# Altium schematic sheet SwitchingRegulator.SchDoc
size A
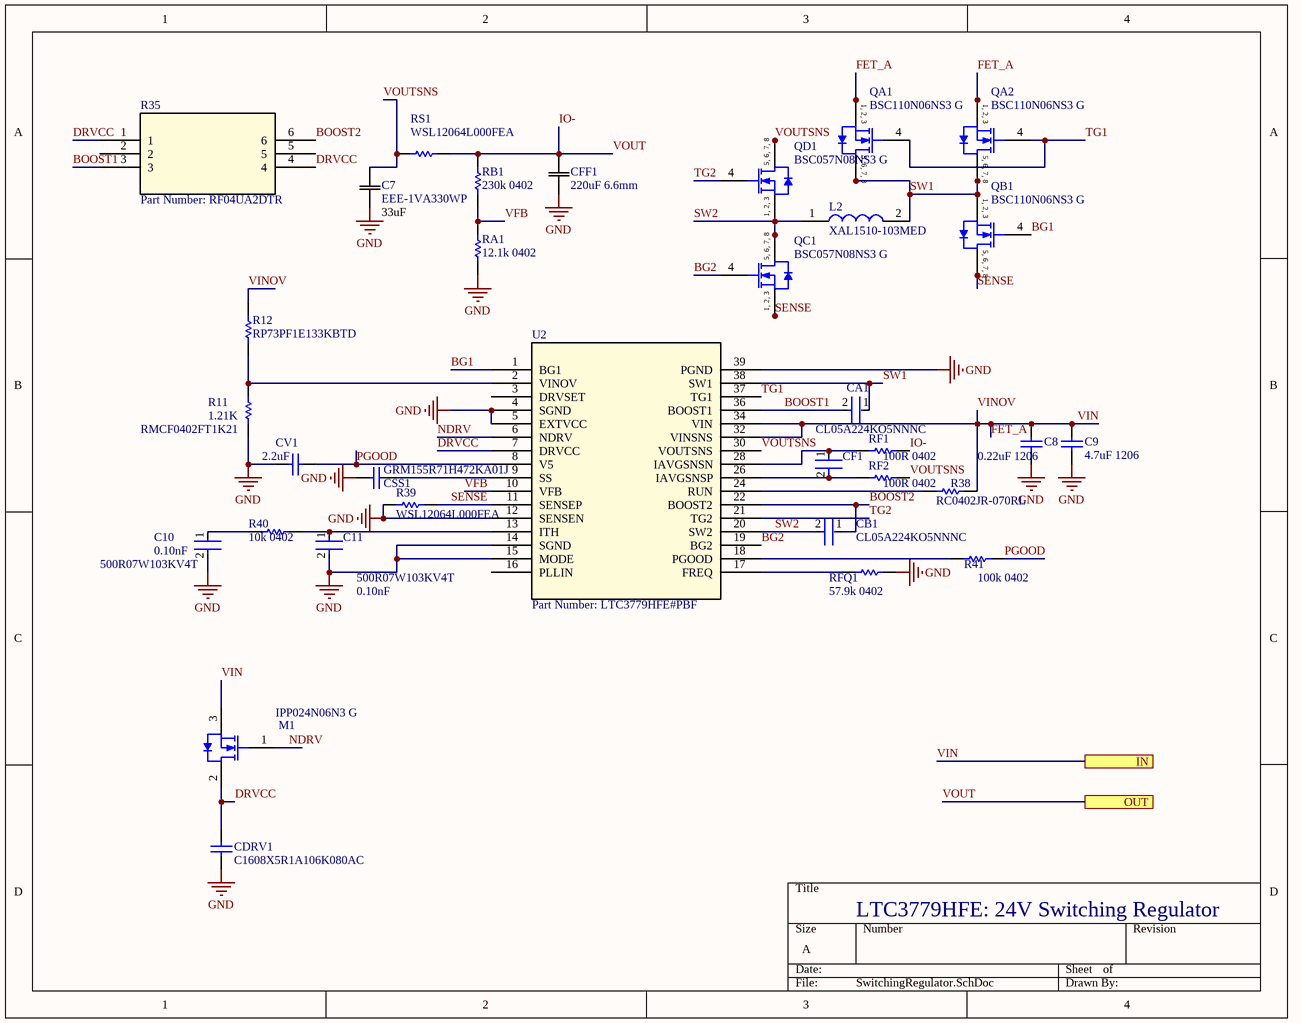
[diagram p0: SwitchingRegulator.SchDoc]

## Parts
C7  EEE-1VA330WP  value 33uF  [CAPAE660X800N]
C8  0.22uF 1206  [CAPC1608X90X35ML10T15]
C9  4.7uF 1206  [CAPC3216X180X50ML20T25]
C10  500R07W103KV4T  Capacitance: 0.10nF  [FP-GRM15-MFG]
C11  500R07W103KV4T  Capacitance: 0.10nF  [FP-GRM15-MFG]
CA1  CL05A224KO5NNNC  [FP-GRM15-MFG]
CB1  CL05A224KO5NNNC  [FP-GRM15-MFG]
CDRV1  C1608X5R1A106K080AC  [CAPC1608X90X20ML10]
CF1  C1608X5R1C335K080AC  [FP-GRM15-MFG]  (value not drawn)
CFF1  220uF 6.6mm  [CAPAE660X800N]
CSS1  GRM155R71H472KA01J  [CAPC1005X55X25NL05T10]
CV1  value 2.2uF  [CAPC1005X55X25ML05T10]  (hidden comment: GRM155R60J225ME15D)
L2  XAL1510-103MED  [XAL1513153MEB]
M1  IPP024N06N3 G  [INF-PG-TO220-3-1_A_V]
QA1  BSC110N06NS3 G  [INF-PG-TDSON-8-1_V]
QA2  BSC110N06NS3 G  [INF-PG-TDSON-8-1_V]
QB1  BSC110N06NS3 G  [INF-PG-TDSON-8-1_V]
QC1  BSC057N08NS3 G  [INF-PG-TDSON-8-1_V]
QD1  BSC057N08NS3 G  [INF-PG-TDSON-8-1_V]
R11  RMCF0402FT1K21  value 1.21K  [RESC1005X40X25NL05T10]
R12  RP73PF1E133KBTD  [RESC1005X40X25NL05T10]
R35  Part Number: RF04UA2DTR  [RF04]
R38  RC0402JR-070RL  [RESC1005X40X25NL05T10]
R39  WSL12064L000FEA  [RESC3216X89X51LL25T25]
R40  10k 0402  [RESC1005X40X25NL05T10]
R41  100k 0402  [RESC1005X40X25NL05T10]
RA1  12.1k 0402  [RESC1005X40X25NL05T10]
RB1  230k 0402  [RESC1005X40X25NL05T10]
RF1  100R 0402  [RESC1005X40X25NL05T05]
RF2  100R 0402  [RESC1005X40X25NL05T05]
RFQ1  57.9k 0402  [RESC1005X40X25NL05T10]
RS1  WSL12064L000FEA  [RESC3216X89X51LL25T25]
U2  Part Number: LTC3779HFE#PBF  [SOP50P640X120-39N]

## Ports
IN, OUT

## Nets
GND: C7.1 C8.1 C9.1 C10.2 C11.2 CDRV1.1 CFF1.1 CSS1.1 CV1.1 R11.2 R39.1 RA1.1 RFQ1.1 U2.4(SGND) U2.5(EXTVCC) U2.12(SENSEN) U2.14(SGND) U2.15(MODE) U2.39(PGND)
BG1: QB1.4(GATE) U2.1(BG1)
BG2: QC1.4(GATE) U2.19(BG2)
BOOST1: CA1.2 R35.3 U2.36(BOOST1)
BOOST2: CB1.1 R35.6 U2.22(BOOST2)
DRVCC: CDRV1.2 M1.2(DRAIN) R35.1 R35.4 U2.7(DRVCC)
FET_A: C8.2 C9.2 M1.3(SOURCE) QA1.1(SOURCE) QA1.2(SOURCE) QA1.3(SOURCE) QA2.1(SOURCE) QA2.2(SOURCE) QA2.3(SOURCE) R12.1 R38.1 U2.32(VINSNS) U2.34(VIN) ; port IN  [also labelled VIN, VINOV]
IO-: CFF1.2 RB1.2 RF1.2 RS1.2 ; port OUT  [also labelled VOUT]
NDRV: M1.1(GATE) U2.6(NDRV)
PGOOD: CV1.2 R41.1 U2.8(V5)
SENSE: QB1.5(DRAIN) QB1.6(DRAIN) QB1.7(DRAIN) QB1.8(DRAIN) QC1.1(SOURCE) QC1.2(SOURCE) QC1.3(SOURCE) R39.2 U2.11(SENSEP)
SW1: CA1.1 L2.2 QA1.5(DRAIN) QA1.6(DRAIN) QA1.7(DRAIN) QA1.8(DRAIN) QA2.5(DRAIN) QA2.6(DRAIN) QA2.7(DRAIN) QA2.8(DRAIN) QB1.1(SOURCE) QB1.2(SOURCE) QB1.3(SOURCE) U2.38(SW1)
SW2: CB1.2 L2.1 QC1.5(DRAIN) QC1.6(DRAIN) QC1.7(DRAIN) QC1.8(DRAIN) QD1.1(SOURCE) QD1.2(SOURCE) QD1.3(SOURCE) U2.20(SW2)
TG1: QA1.4(GATE) QA2.4(GATE) U2.37(TG1)
TG2: QD1.4(GATE) U2.21(TG2)
VFB: RA1.2 RB1.1 U2.10(VFB)
VOUTSNS: C7.2 QD1.5(DRAIN) QD1.6(DRAIN) QD1.7(DRAIN) QD1.8(DRAIN) RF2.2 RS1.1 U2.30(VOUTSNS)
NetC10_1: C10.1 R40.2
NetC11_1: C11.1 R40.1 U2.13(ITH)
NetCF1_1: CF1.1 RF1.1 U2.28(IAVGSNSN)
NetCF1_2: CF1.2 RF2.1 U2.26(IAVGSNSP)
NetCSS1_2: CSS1.2 U2.9(SS)
NetR11_1: R11.1 R12.2 U2.2(VINOV)
NetR38_2: R38.2 U2.24(RUN)
NetR41_2: R41.2 U2.18(PGOOD)
NetRFQ1_2: RFQ1.2 U2.17(FREQ)

Not connected (* = marked no-connect by the designer): R35 2 5; U2 3(DRVSET) 16(PLLIN)

## Notes on the sheet
- LTC3779HFE: 24V Switching Regulator
- (in symbol CMP-1091-00029-1) 5, 6, 7, 8; 1, 2, 3
- (in symbol CMP-1091-00074-1) 1, 2, 3; 5, 6, 7, 8

## Library data of the parts
C7 = UCV1V221MCL1GS: CAP ALUM 33UF 20% 35V SMD; Manufacturer 1: Panasonic Electronic Components; Manufacturer Part Number 1: EEE-1VA330WP
C8 = CMP-2100-03642-1: Chip Capacitor, 10 nF, +/- 10%, 50 V, -55 to 125 degC, 0603 (1608 Metric), RoHS, Tape and Reel; Manufacturer: Murata; Insulation Resistance: 10GR; Dielectric: X7R; Voltage Rating: 50V; Capacitance: 10nF; Material: Ceramic; Package Quantity: 1; Lead Free: LeadFree; Case/Package: 0603; Termination: SMD/SMT; REACH SVHC: Unknown; Manufacturer URL: http://www.murata.com/; Datasheet URL: http://search.murata.co.jp/Ceramy/image/img/A01X/G101/ENG/GRM188R71H103KA01-01.pdf; Mount: SurfaceMount; Datasheet Version: 42401.0; Number of Pins: 2; Length: 1.6mm; Voltage: 50V; Depth: 0.8mm; Tolerance: 10%; Min Operating Temperature: -55degC; Voltage Rating (DC): 50V; Max Operating Temperature: 125degC; Package Description: 2-Pin Surface Mount Device, Body 1.6 x 0.8 mm; RoHSCompliant: True; Case Code (Imperial): 0603; Width: 0.031inch; Case Code (Metric): 1608; Height: 0.8mm; Package Reference: 0603; Packaging: TapeandReel; Thickness: 0.035inch; Dielectric Material: Ceramic
C9 = CMP-2000-04991-1: Chip Capacitor, 1 uF, +/- 10%, 25 V, -55 to 125 degC, 1206 (3216 Metric), RoHS, Tape and Reel; Manufacturer: Kemet; Temperature Coefficient / Code: +/-15%; Capacitance: 1uF; Dielectric: X7R; Voltage Rating DC: 25V; Capacitance - nF: 1000nF; Class: Class1; Case Length: 3.2mm; Type: SMDMLCCX7R6.3-250VDCCommericalGrade; Case Width: 1.6mm; Product: GeneralTypeMLCCs; Datasheet URL: https://ciiva.com/datasheet-click-18194173?src=ciiva&sig=6daff8c4; Operating Temperature Range: -55Cto+125C; Series: C1206C; RoHS: Details; Product Category: MultilayerCeramicCapacitorsMLCC-SMD/SMT; Manufacturer URL: http://www.kemet.com/; Minimum Operating Temperature: -55C; Dimensions: 1.6mmWx3.2mmLx1.6mmH; Termination Style: SMD/SMT; Brand: Kemet; Packaging: Reel; Package / Case: 1206(3216metric); Case Code - mm: 3216; Datasheet Version: Jul-14; Factory Pack Quantity: 2000; Package Description: 2-Pin Surface Mount Device, Body 3.2 x 1.6 mm; Tolerance: 10%; Package Reference: 1206; Case Height: 1.6mm; Case Code - in: 1206; Maximum Operating Temperature: +125C; Voltage Rating: 25V
C10 C11 = CMP-06035-000102-1: CAP CER 0.1UF 16V X7R 0402; Manufacturer Part Number: GRM155R71C104KA88D; Manufacturer: Murata; Manufacturer 1: Johanson Dielectrics Inc.; Standoff Height: 0mm; Tolerance: 10%; Voltage Rating: 16Vdc; Material: Ceramic; Value: 0.10μF; RoHS: TRUE; Temperature Characteristic: X7R; Octopart: https://octopart.com/grm155r71c104ka88d-murata-196880; Digikey Description: CAP CER 0.1UF 16V X7R 0402; Device Class L3: Ceramic Capacitors; Height: 0.55mm; ComponentLink2Description: Datasheet; Temperature Range Low: -55°C; Ipc Land Pattern Name: CAPC10050X219; ComponentLink2URL: https://search.murata.co.jp/Ceramy/image/img/A01X/G101/ENG/GRM155R71H471KA01-01A.pdf; Device Class L1: Passive Components; Lead Free: yes; Category: Cap; Package: GRM15; Temperature: -55°C to +125°C; Device Class L2: Capacitors; Temperature Range High: +125°C; Mouser Description: 0402 0.1 uF 16V ±10 % Tolerance X7R SMT Multilayer Ceramic Capacitor; Manufacturer Part Number 1: 500R07W103KV4T
CA1 CB1 = CMP-06035-000102-1: CAP CER 0.22UF 16V X5R 0402; Manufacturer 1: Samsung Electro-Mechanics; Value: 0.22μF; Manufacturer Part Number 1: CL05A224KO5NNNC
CDRV1 = CMP-2000-04979-1: Chip Capacitor, 10 uF, +/- 10%, 10 V, -55 to 85 degC, 0603 (1608 Metric), RoHS, Tape and Reel; PCN Part Number: MLCCPartNumberChange30/Nov/2012; Manufacturer: TDK; Temperature Coefficient: X5R; Product Training Modules: CSeriesGeneralApplicationsSEAT,CCV,andTVCLDesignToolsGuidetoReplacinganElectrolyticCapacitorwithanMLCC; Online Catalog: CSeries,GeneralPurpose; Voltage - Rated: 10V; Other Names: 445-7486-1; Capacitance: 10µF; Design Resources: 20WNon-IsolatedBuckLEDDriverUsingPLLNK460KG; Kits: 445-9003-KIT-ND-KITCAPCERHICAPMLCCSMD; Height - Seated (Max): -; Family: CeramicCapacitors; Package Description: 2-Pin Surface Mount Device, Body 1.6 x 0.8 mm; Category: Capacitors; Datasheet Version: Mar-15; RoHS Information: RoHSCertificate-MLCC; Thickness (Max): 0.035"(0.90mm); Operating Temperature: -55degC~85degC; Package Reference: 603; Series: C; Applications: GeneralPurpose; Datasheet URL: http://download.siliconexpert.com/pdfs/2015/4/21/15/54/45/779/tdk_/manual/37024850441143360mlcc_commercial_general_en.pdf; Features: -; Lead Style: -; Lead Spacing: -; Ratings: -; Size / Dimension: 0.063"Lx0.031"W(1.60mmx0.80mm); Tolerance: ±10%; Mounting Type: SurfaceMount,MLCC; Standard Package: 1; Package / Case: 0603(1608Metric); Manufacturer URL: http://www.tdk.com/; Packaging: CutTape(CT)
CF1 = CMP-06035-000102-1: CAP CER 3.3UF 16V X5R 0603; Manufacturer 1: TDK Corporation; Value: 3.3uF; Manufacturer Part Number 1: C1608X5R1C335K080AC
CFF1 = UCV1V221MCL1GS: No Description Available; Vendor: Nichicon; Built_By: EMA_Cory; SourceLibrary: Nichicon_2019-09-13; Manufacturer_Part_Number: UCV1V221MCL1GS; Copyright: Copyright (C) 2018 Accelerated Designs. All rights reserved; RefDes: RefDes; Type: DEV; Value: Value
CSS1 = CMP-2008-04033-1: CAP CER 4700PF 50V X7R 0402; Manufacturer 1: Murata; Manufacturer Part Number 1: GRM155R71H472KA01J
CV1 = CMP-2008-04543-1: CAP CER 2.2UF 6.3V X5R 0402; Manufacturer 1: Murata Electronics; Manufacturer Part Number 1: GRM155R60J225ME15D
L2 = XAL1510-103MED: Inductor; Manufacturer_Name: COILCRAFT; Datasheet Link: https://www.coilcraft.com/pdfs/xal1510.pdf; Height: 13mm; Manufacturer_Part_Number: XAL1510-103MED; Arrow Part Number: XAL1510-103MED; Mouser Part Number: 994-XAL1510-103MED; Mouser Price/Stock: https://www.mouser.co.uk/ProductDetail/Coilcraft/XAL1510-103MED?qs=41NYZ3YTmyo92lKEhFAS8w%3D%3D
M1 = CMP-1091-00132-1: N-Channel OptiMOS 3 Power-Transistor, 60 V VDS, 120 A ID, -55 to 175 degC, PG-TO220-3-1, Tube, Green; Manufacturer: Infineon; RDS (on) (max): 2.4Â mOhm; VGS(th) (max): 4Â V; VGS(th) (min): 2Â V; Polarity: N; Rth: 0.6Â K/W; IDpuls (max): 480Â A; Ptot (max): 250Â W; VDS (max): 60Â V; QG: 206Â nC; Green: TRUE; RthJA (max): 62Â K/W; ID (max): 120Â A; PackageDescription: 3-Pin Plastic (Green) Transistor Single Outline Package, 10.03 x 8.98 mm Body, 2.54 mm Pitch; ComponentLink2Description: Datasheet; ComponentLink2URL: http://www.infineon.com/dgdl/IPP024N06N3_Rev2.2.pdf?folderId=db3a304313b8b5a60113cee8763b02d7&fileId=db3a30432313ff5e01239f1f52a67151; PartNumber: IPP024N06N3 G; ComponentLink3Description: Package Specification; ComponentLink1Description: Manufacturer URL; Packing: Tube; ComponentLink3URL: http://www.infineon.com/dgdl/IPP028N08N3_Rev1%5B1%5D.0.pdf?folderId=db3a304313b8b5a60113cee8763b02d7&fileId=db3a30432313ff5e0123a3c08e7326b5; RthJC (max): 0.6Â K/W; PackageVersion: Rev. 05, 08/2007; ComponentLink1URL: http://www.infineon.com/; Halogen-free: TRUE; Mounting Technology: Through Hole; DatasheetVersion: Rev. 2.2; PackageReference: PG-TO220-3-1
QA1 QA2 QB1 = CMP-1091-00074-1: N-Channel OptiMOS 3 Power-Transistor, 60 V VDS, 50 A ID, -55 to 150 degC, PG-TDSON-8-1, Reel, Green; Manufacturer: Infineon; RDS (on) (max): 11Â mOhm; ID (max): 50Â A; VGS(th) (max): 4Â V; RthJA (max): 62 K/W; Ptot (max): 50Â W; VGS(th) (min): 2Â V; VDS (max): 60Â V; QG: 25Â nC; IDpuls (max): 200Â A; Polarity: N; Rth: 2.5Â K/W; Green: TRUE; Packing: Reel; DatasheetVersion: Rev. 2.3; ComponentLink2URL: http://www.infineon.com/dgdl/BSC110N06NS3_Rev2.3.pdf?folderId=db3a30431ddc9372011ebafa04517f8b&fileId=db3a30431ddc9372011ebb0be43c7fe6; ComponentLink1Description: Manufacturer URL; PackageDescription: 8-Pin Plastic (Green) Thin Dual Small Outline Non-Leaded Package, 5.15 x 5.9 mm Body, 1.27 mm Pitch; ComponentLink3Description: Package Specification; PackageReference: PG-TDSON-8-1; ComponentLink1URL: http://www.infineon.com/; ComponentLink3URL: http://www.infineon.com/cms/packages/SMD_-_Surface_Mounted_Devices/P-PG-TDSON/P-PG-TDSON-08-01x_2x_3.html?__locale=en; ComponentLink2Description: Datasheet; Halogen-free: TRUE; PartNumber: BSC110N06NS3 G; Mounting Technology: Surface Mount; RthJC (max): 2.5Â K/W
QC1 QD1 = CMP-1091-00029-1: N-Channel OptiMOS 3 Power-Transistor, 80 V VDS, 100 A ID, -55 to 150 degC, PG-TDSON-8-1, Reel, Green; Manufacturer: Infineon; Green: TRUE; Ptot (max): 114Â W; RDS (on) (max): 5.7Â mOhm; RthJC (max): 1.1Â K/W; QG: 42Â nC; Polarity: N; RthJA (max): 62Â K/W; IDpuls (max): 400Â A; VGS(th) (min): 2Â V; VGS(th) (max): 3.5Â V; VDS (max): 80Â V; ID (max): 100Â A; ComponentLink1Description: Manufacturer URL; DatasheetVersion: Rev. 2.4; ComponentLink3Description: Package Specification; PartNumber: BSC057N08NS3 G; PackageReference: PG-TDSON-8-1; PackageDescription: 8-Pin Plastic (Green) Thin Dual Small Outline Non-Leaded Package, 5.15 x 5.9 mm Body, 1.27 mm Pitch; Mounting Technology: Surface Mount; Packing: Reel; Halogen-free: TRUE; ComponentLink3URL: http://www.infineon.com/cms/packages/SMD_-_Surface_Mounted_Devices/P-PG-TDSON/P-PG-TDSON-08-01x_2x_3.html?__locale=en; ComponentLink2URL: http://www.infineon.com/dgdl/BSC057N08NS3G_rev2.4.pdf?folderId=db3a304313b8b5a60113cee8763b02d7&fileId=db3a30431add1d95011ae803c9345616; ComponentLink2Description: Datasheet; ComponentLink1URL: http://www.infineon.com/; Rth: 1.1Â K/W
R11 = CMP-2002-07912-1: RES 1.21K OHM 1% 1/16W 0402; Manufacturer: Yageo / Phycomp; Part Number: RC0402JR-070RL
R12 = CMP-2002-07912-1: RES 133K OHM 0.1% 1/10W 0402; Manufacturer 1: TE Connectivity Passive Product; Manufacturer Part Number 1: RP73PF1E133KBTD
R35 = RF04UA2DTR: No Description Available; Vendor: ROHM Semiconductor; Built_By: EMA_Matt; SourceLibrary: Rohm_2019-09-23; Manufacturer_Part_Number: RF04UA2DTR; Copyright: Copyright (C) 2018 Accelerated Designs. All rights reserved; RefDes: RefDes; Type: DEV; Value: Value
R38 = CMP-2002-07912-1: Manufacturer: Yageo / Phycomp; Part Number: RC0402JR-070RL
R39 RS1 = CMP-2003-04339-1: RES SMD 4mR 1% 1/8W 1206 /; Manufacturer 1: Vishay Dale; Manufacturer Part Number 1: WSL12064L000FEA; Description: RES SMD 4mR 1% 1/8W 1206
R40 R41 RA1 RB1 RFQ1 = CMP-2002-07912-1: Manufacturer: Yageo / Phycomp; Part Number: RC0402JR-070RL
RF1 RF2 = CMP-2002-08127-1: Part Number: CRCW0402100RFKED; Manufacturer: Vishay Dale
U2 = LTC3779HFE#PBF: No Description Available; Built_By: EMA_Jessica; Vendor: Analog Devices Inc; SourceLibrary: Analog_Devices_2018-09-28; Copyright: Copyright (C) 2016 Accelerated Designs. All rights reserved; Manufacturer_Part_Number: LTC3779HFE#PBF; RefDes: RefDes; Type: DEV; Value: Value